# Altium project LED.PrjPcb
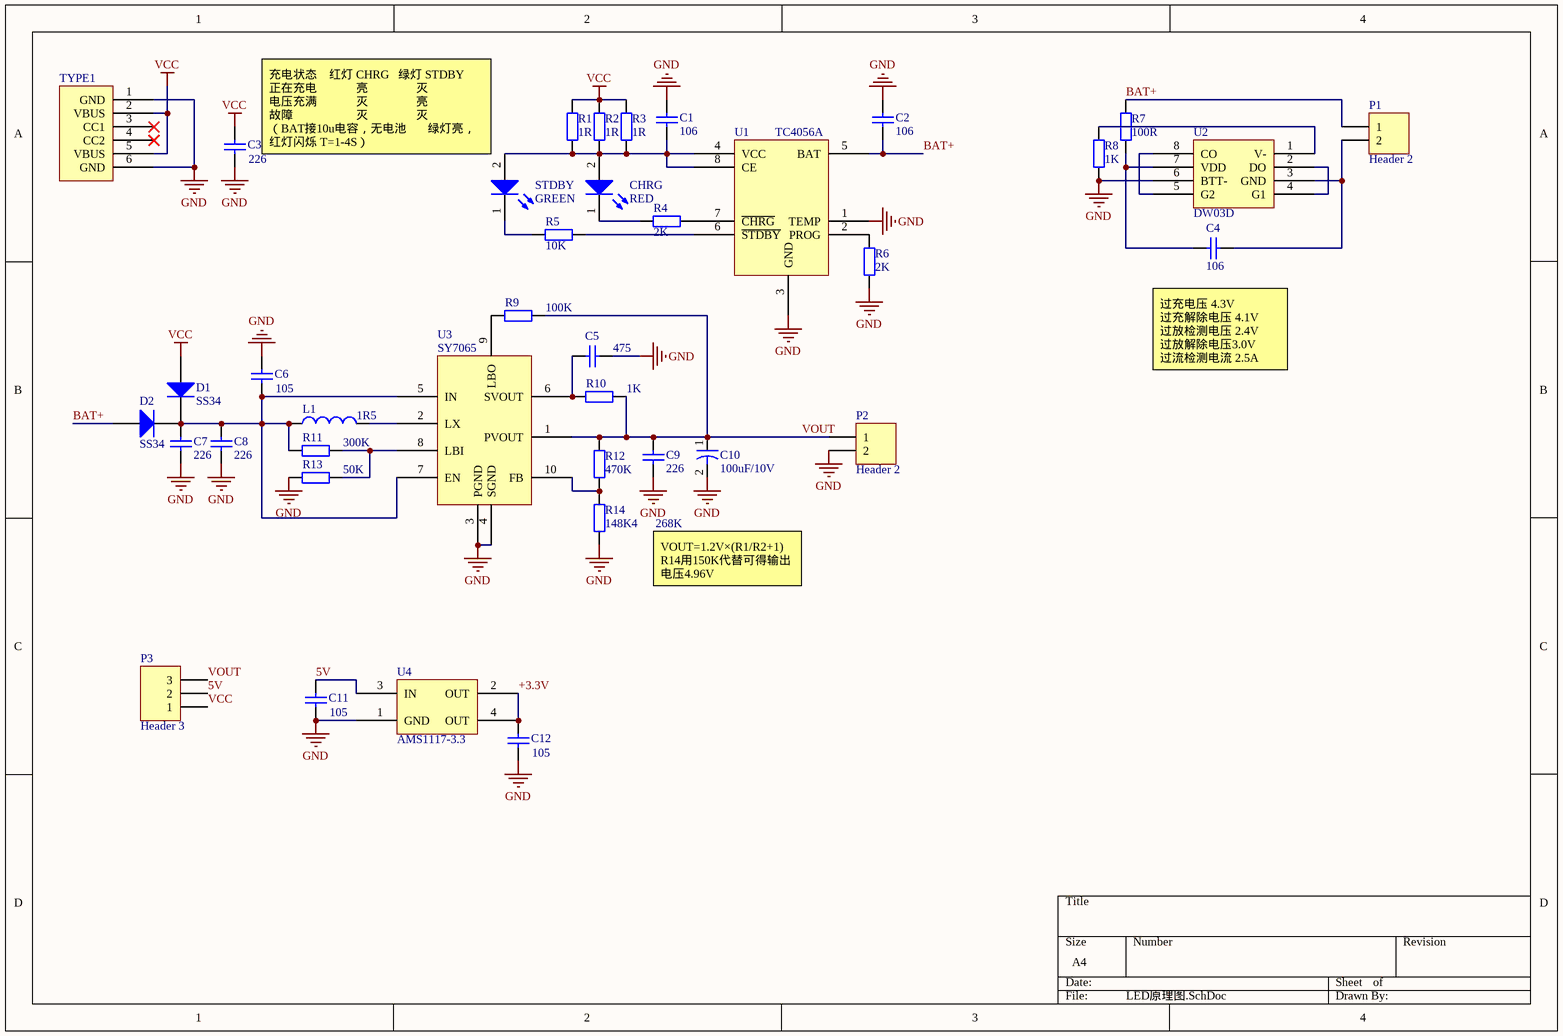
[diagram p0: LED原理图.SchDoc]
3 sheets, 110 parts. Net scope: global (net labels, ports and power ports of the same name join across sheets).
Board file: LED_PCB.PcbDoc
Sheets:
  LED原理图.SchDoc
  BLE主控原理图.SchDoc
  功放原理图.SchDoc

## Sheet LED原理图.SchDoc
size A4

### Parts
C1  value 106  [0805C]  (hidden comment: Cap)
C2  value 106  [0805C]  (hidden comment: Cap)
C3  value 226  [0805C]  (hidden comment: Cap)
C4  value 106  [0805C]  (hidden comment: Cap)
C5  value 475  [0805C]  (hidden comment: Cap)
C6  value 105  [0805C]  (hidden comment: Cap)
C7  value 226  [0805C]  (hidden comment: Cap)
C8  value 226  [0805C]  (hidden comment: Cap)
C9  value 226  [0805C]  (hidden comment: Cap)
C10  value 100uF/10V  [C1206]  (hidden comment: Cap2)
C11  value 105  [0805C]  (hidden comment: Cap)
C12  value 105  [0805C]  (hidden comment: Cap)
CHRG  RED  [LED-0805]
D1  SS34  [LC-SMA(DO-214AC)_S2]
D2  SS34  [LC-SMA(DO-214AC)_S2]
L1  value 1R5  [电感SMD]  (hidden comment: Inductor)
P1  Header 2  [XH2.54-2]
P2  Header 2  [XH2.54-2]
P3  Header 3  [XH2.54-3]
R1  value 1R  [0805R]  (hidden comment: Res2)
R2  value 1R  [0805R]  (hidden comment: Res2)
R3  value 1R  [0805R]  (hidden comment: Res2)
R4  value 2K  [0805R]  (hidden comment: Res2)
R5  value 10K  [0805R]  (hidden comment: Res2)
R6  value 2K  [0805R]  (hidden comment: Res2)
R7  value 100R  [0805R]  (hidden comment: Res2)
R8  value 1K  [0805R]  (hidden comment: Res2)
R9  value 100K  [0805R]  (hidden comment: Res2)
R10  value 1K  [0805R]  (hidden comment: Res2)
R11  value 300K  [0805R]  (hidden comment: Res2)
R12  value 470K  [0805R]  (hidden comment: Res2)
R13  value 50K  [0805R]  (hidden comment: Res2)
R14  value 148K4      268K  [0805R]  (hidden comment: Res2)
STDBY  GREEN  [LED-0805]
TYPE1  TYPE-CF-6P-RAT-L6.8W  [TYPE-CF-6P-RAT-L6.8W]  (value not drawn)
U1  TC4056A  [SOP-8]
U2  DW03D  [LC-TSSOP-8_3x4.4x065P]
U3  SY7065  [QFN2*2-10]
U4  AMS1117-3.3  [SOT-233]

### Nets
5V: C11.2 P3.2 U4.3(IN)
+3.3V: C12.2 U4.2(OUT) U4.4(OUT)
GND: C1.2 C2.2 C3.1 C5.1 C6.2 C7.1 C8.1 C9.2 C10.2 C11.1 C12.1 P2.2 R6.1 R8.2 R13.1 R14.1 TYPE1.1(GND) TYPE1.6(GND) U1.1(TEMP) U1.3(GND) U2.6(BTT-) U3.3(PGND) U3.4(SGND) U4.1(GND)
VCC: C3.2 D1.1(A) P3.1 R1.1 R2.1 R3.1 TYPE1.2(VBUS) TYPE1.5(VBUS)
BAT+: C2.1 D2.1(A) P1.1 R7.1 U1.5(BAT)
VOUT: C9.1 C10.1 P2.1 P3.3 R9.2 R10.2 R12.2 U3.1(PVOUT)
NetC1_1: C1.1 CHRG.2(A) R1.2 R2.2 R3.2 STDBY.2(A) U1.4(VCC) U1.8(CE)
NetC4_1: C4.1 P1.2 U2.3(GND)
NetC4_2: C4.2 R7.2 U2.7(VDD)
NetC5_2: C5.2 R10.1 U3.6(SVOUT)
NetC6_1: C6.1 C7.2 C8.2 D1.2(K) D2.2(K) L1.1 R11.1 U3.5(IN) U3.7(EN)
NetCHRG_1: CHRG.1(K) R4.1
NetL1_2: L1.2 U3.2(LX)
NetR4_2: R4.2 U1.7(~{CHRG})
NetR5_1: R5.1 STDBY.1(K)
NetR5_2: R5.2 U1.6(~{STDBY})
NetR6_2: R6.2 U1.2(PROG)
NetR8_1: R8.1 U2.1(V-)
NetR9_1: R9.1 U3.9(LBO)
NetR11_2: R11.2 R13.2 U3.8(LBI)
NetR12_1: R12.1 R14.2 U3.10(FB)
NetU2_2: U2.2(DO) U2.4(G1)
NetU2_5: U2.5(G2) U2.8(CO)

Not connected (* = marked no-connect by the designer): TYPE1 3(CC1)* 4(CC2)*

### Notes on the sheet
- 充电状态    红灯 CHRG   绿灯 STDBY
  正在充电             亮                灭
  电压充满             灭                亮
  故障                     灭                灭
  （BAT接10u电容，无电池       绿灯亮，红灯闪烁 T=1-4S）
- (near C4) 过充电压 4.3V
  过充解除电压 4.1V
  过放检测电压 2.4V
  过放解除电压3.0V
  过流检测电流 2.5A
- VOUT=1.2V×(R1/R2+1)
  R14用150K代替可得输出电压4.96V

### Library data of the parts
C1-C9 C11 C12 = Cap: Capacitor; Published: 8-Jun-2000; LatestRevisionDate: 17-Jul-2002; LatestRevisionNote: Re-released for DXP Platform.; PackageReference: RAD-0.3; Publisher: Altium Limited; PackageDescription: Radial Cap, Thru-Hole; 2 Leads; 0.3 in Pin Spacing
C10 = Cap2: Capacitor; Published: 23-Sep-2002; PackageReference: CAPR5-4X5; Publisher: Altium Limited; PackageDescription: Capacitor; 2 Leads
CHRG STDBY = LED0: Typical INFRARED GaAs LED; Published: 8-Jun-2000; LatestRevisionDate: 08-Jul-2005; LatestRevisionNote: Mech Layer 1 removed.; PackageReference: LED-0; Publisher: Altium Limited; PackageDescription: LED; 2 Leads
D1 D2 = Diode: Default Diode; Published: 8-Jun-2000; LatestRevisionDate: 17-Jul-2002; LatestRevisionNote: Re-released for DXP Platform.; PackageVersion: Sep-1996; PackageReference: SMC; Publisher: Altium Limited; PackageDescription: DO-214-AB/SMC; 2 C-Bend Leads; Body 7.9 x 5.9 mm, inc. leads (LxW); Code_JEDEC: DO-214-AB
L1 = Inductor: Code_IEC: 1005; Published: 8-Jun-2000; LatestRevisionDate: 29-May-2009; LatestRevisionNote: IPC-7351 Footprint Added.; PackageReference: 0402-A; Publisher: Altium Limited; PackageDescription: Chip Inductor; Code_JEITA: 0402
P1 P2 = Header 2: Header, 2-Pin; LatestRevisionDate: 17-Jul-2002; LatestRevisionNote: Re-released for DXP Platform.; Publisher: Altium Limited
P3 = Header 3: Header, 3-Pin; LatestRevisionDate: 17-Jul-2002; LatestRevisionNote: Re-released for DXP Platform.; Publisher: Altium Limited
R1-R14 = Res2: Resistor; Published: 8-Jun-2000; LatestRevisionDate: 17-Jul-2002; LatestRevisionNote: Re-released for DXP Platform.; PackageReference: AXIAL-0.4; Publisher: Altium Limited; PackageDescription: Axial Device, Thru-Hole; 2 Leads; 0.4 in Pin Spacing

## Sheet BLE主控原理图.SchDoc
size A4
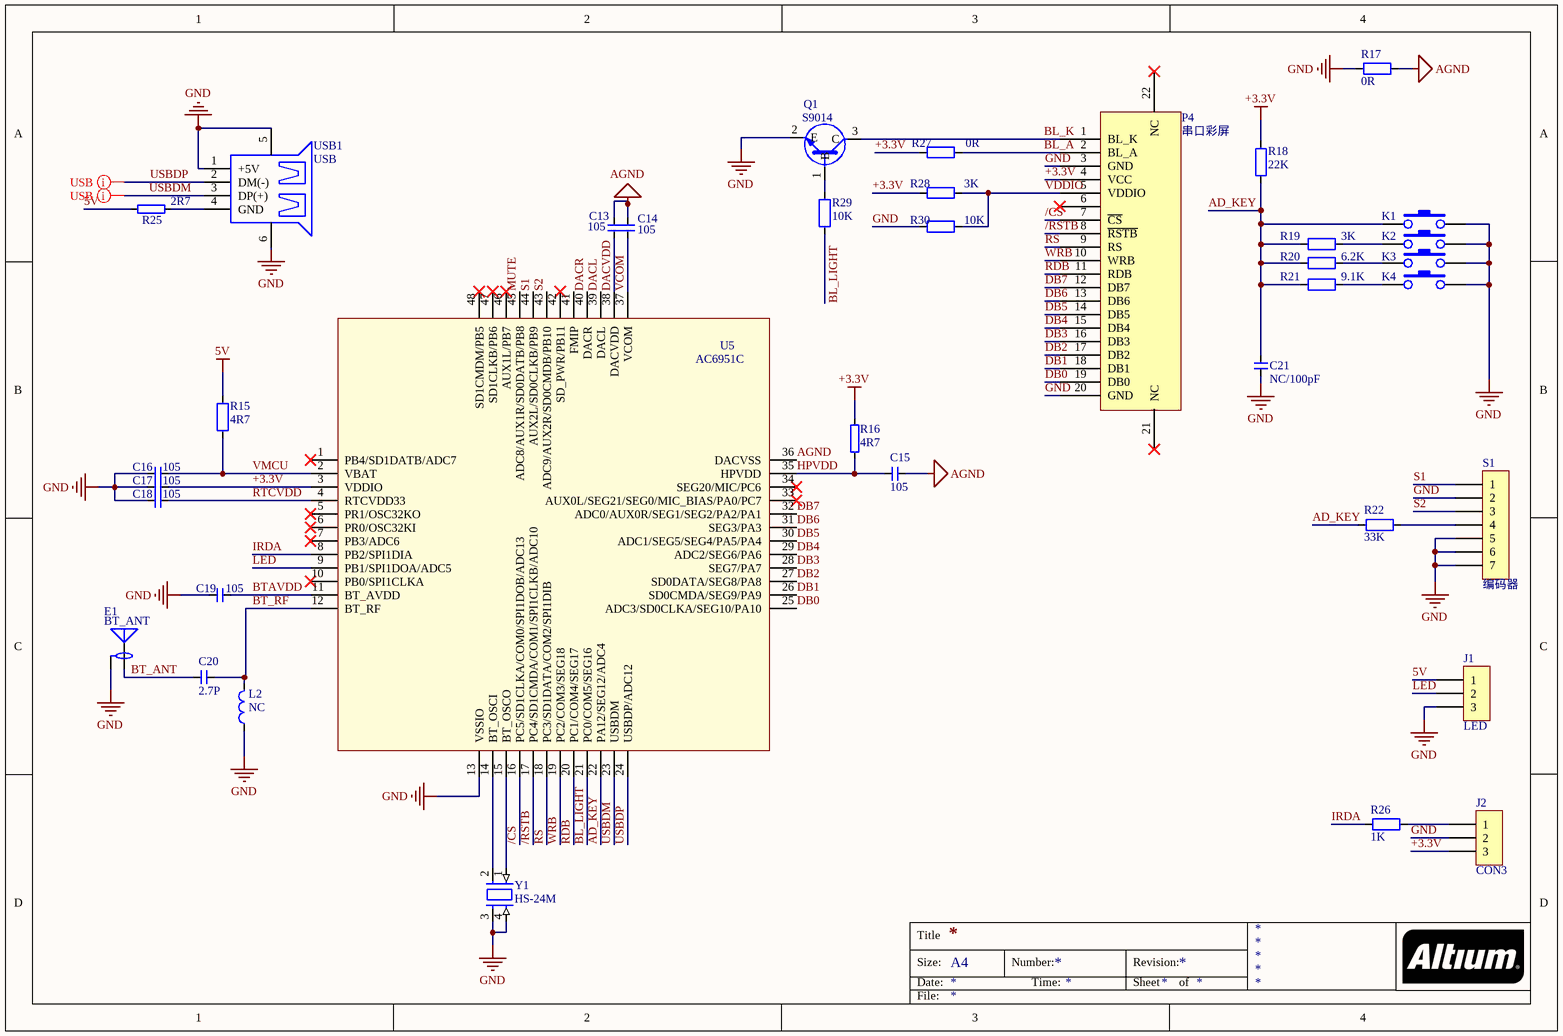
[diagram p1: BLE主控原理图.SchDoc]

### Parts
C13  105  [C0603]
C14  105  [C0603]
C15  105  [C0603]
C16  105  [C0603]
C17  105  [C0603]
C18  105  [C0603]
C19  105  [C0603]
C20  2.7P  [C0603]
C21  NC/100pF  [C0603]
E1  BT_ANT  [新F天线]
J1  LED  [CON-3X2.54]
J2  CON3  [CON-3X2.54]
K1  (no value)  [KEY]
K2  (no value)  [KEY]
K3  (no value)  [KEY]
K4  (no value)  [KEY]
L2  NC  [L0603]
P4  串口彩屏  [FFC-P20-1MM]
Q1  S9014  [SOT23]
R15  4R7  [R0805]
R16  4R7  [R0603]
R17  0R  [R0603]
R18  22K  [R0603]
R19  3K  [R0603]
R20  6.2K  [R0603]
R21  9.1K  [R0603]
R22  33K  [R0603]
R25  2R7  [R0603]
R26  1K  [R0603]
R27  0R  [R0603]
R28  3K  [R0603]
R29  10K  [R0603]
R30  10K  [R0603]
S1  编码器  [BMQ+PUSH]
U5  AC6951C  [LQFP48]
USB1  USB  [USBSMT]
Y1  HS-24M  [JZ]

### Nets
5V: J1.1 R15.1 R25.1
+3.3V: C17.2 J2.3 P4.4(VCC) R16.2 R18.2 R27.1 R28.2 U5.3(VDDIO)
AGND: C13.2 C14.2 C15.1 R17.2 U5.36(DACVSS)
GND: C16.1 C17.1 C18.1 C19.1 C21.2 E1.2 J1.3 J2.2 K1.2 K2.2 K3.2 K4.2 L2.1 P4.3(GND) P4.20(GND) Q1.2(E) R17.1 R30.2 S1.2 S1.5 S1.6 S1.7 U5.13(VSSIO) USB1.1(+5V) USB1.5 USB1.6 Y1.3 Y1.4
/CS: P4.7(~{CS}) U5.16(PC5/SD1CLKA/COM0/SPI1DOB/ADC13)
/RSTB: P4.8(~{RSTB}) U5.17(PC4/SD1CMDA/COM1/SPI1CLKB/ADC10)
AD_KEY: C21.1 K1.1 R18.1 R19.1 R20.1 R21.1 R22.1 U5.22(PA12/SEG12/ADC4)
BL_A: P4.2(BL_A) R27.2
BL_K: P4.1(BL_K) Q1.3(C)
BL_LIGHT: R29.1 U5.21(PC0/COM5/SEG16)
BT_ANT: C20.1 E1.1
BT_RF: C20.2 L2.2 U5.12(BT_RF)
BTAVDD: C19.2 U5.11(BT_AVDD)
DACL: U5.39(DACL)
DACR: U5.40(DACR)
DACVDD: C13.1 U5.38(DACVDD)
DB0: P4.19(DB0) U5.25(ADC3/SD0CLKA/SEG10/PA10)
DB1: P4.18(DB1) U5.26(SD0CMDA/SEG9/PA9)
DB2: P4.17(DB2) U5.27(SD0DATA/SEG8/PA8)
DB3: P4.16(DB3) U5.28(SEG7/PA7)
DB4: P4.15(DB4) U5.29(ADC2/SEG6/PA6)
DB5: P4.14(DB5) U5.30(ADC1/SEG5/SEG4/PA5/PA4)
DB6: P4.13(DB6) U5.31(SEG3/PA3)
DB7: P4.12(DB7) U5.32(ADC0/AUX0R/SEG1/SEG2/PA2/PA1)
HPVDD: C15.2 R16.1 U5.35(HPVDD)
IRDA: R26.1 U5.8(PB2/SPI1DIA)
LED: J1.2 U5.9(PB1/SPI1DOA/ADC5)
MUTE: U5.45(ADC8/AUX1R/SD0DATB/PB8)
RDB: P4.11(RDB) U5.20(PC1/COM4/SEG17)
RS: P4.9(RS) U5.18(PC3/SD1DATA/COM2/SPI1DIB)
RTCVDD: C18.2 U5.4(RTCVDD33)
S1: S1.1 U5.44(AUX2L/SD0CLKB/PB9)
S2: S1.3 U5.43(ADC9/AUX2R/SD0CMDB/PB10)
USBDM: U5.23(USBDM) USB1.3(DP(+))
USBDP: U5.24(USBDP/ADC12) USB1.2(DM(-))
VCOM: C14.1 U5.37(VCOM)
VDDIO: P4.5(VDDIO) R28.1 R30.1
VMCU: C16.2 R15.2 U5.2(VBAT)
WRB: P4.10(WRB) U5.19(PC2/COM3/SEG18)
NetJ2_1: J2.1 R26.2
NetK2_1: K2.1 R19.2
NetK3_1: K3.1 R20.2
NetK4_1: K4.1 R21.2
NetQ1_1: Q1.1(B) R29.2
NetR22_2: R22.2 S1.4
NetR25_2: R25.2 USB1.4(GND)
NetU5_14: U5.14(BT_OSCI) Y1.2
NetU5_15: U5.15(BT_OSCO) Y1.1

Not connected (* = marked no-connect by the designer): P4 6* 21(NC)* 22(NC)*; U5 1(PB4/SD1DATB/ADC7)* 5(PR1/OSC32KO)* 6(PR0/OSC32KI)* 7(PB3/ADC6)* 10(PB0/SPI1CLKA)* 33(AUX0L/SEG21/SEG0/MIC_BIAS/PA0/PC7)* 34(SEG20/MIC/PC6)* 41(FMIP) 42(SD_PWR/PB11)* 46(AUX1L/PB7)* 47(SD1CLKB/PB6)* 48(SD1CMDM/PB5)*

### Layout directives
USBDP: True: USBDP
USBDM: True: USBDM

### Notes on the sheet
- Title
- Size:
- Date:
- A4
- Number:
- Time:
- Revision:
- Sheet
- of
- File:

### Library data of the parts
C13-C21 = CAP-0603
J1 J2 = CON3: Connector
K1-K4 = Key
L2 = L
P4 = LCD-20P
Q1 = NPN
R15 R17-R22 R26-R30 = RES-0603
R16 R25 = RES
S1 = CON7: Connector
Y1 = CRYSTAL

## Sheet 功放原理图.SchDoc
size A4
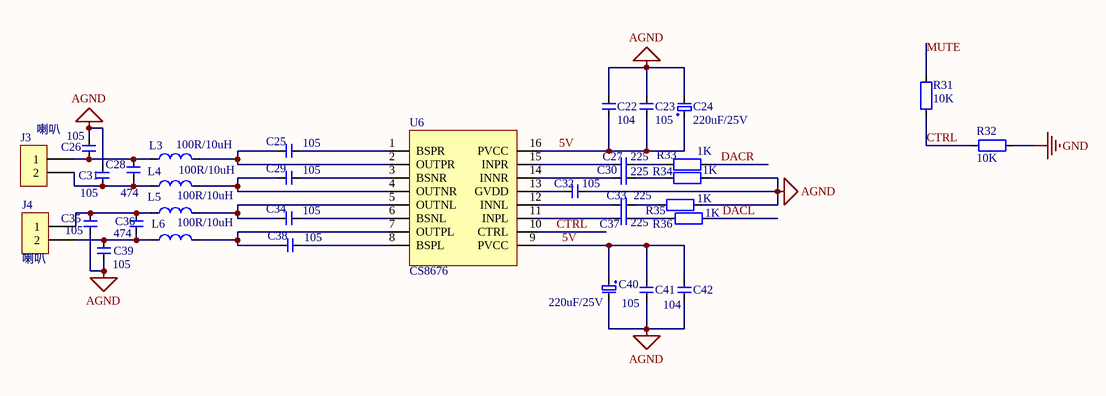
[diagram p2: 功放原理图.SchDoc]

### Parts
C22  104  [C0603]
C23  105  [C0603]
C24  220uF/25V  [EC2.5-6.3]
C25  105  [C0603]
C26  105  [C0603]
C27  225  [C0603]
C28  474  [C0603]
C29  105  [C0603]
C30  225  [C0603]
C31  105  [C0603]
C32  105  [C0603]
C33  225  [C0603]
C34  105  [C0603]
C35  105  [C0603]
C36  474  [C0603]
C37  225  [C0603]
C38  105  [C0603]
C39  105  [C0603]
C40  220uF/25V  [EC2.5-6.3]
C41  105  [C0603]
C42  104  [C0603]
J3  喇叭  [CON-2X2.54]
J4  喇叭  [CON-2X2.54]
L3  100R/10uH  [R1206]
L4  100R/10uH  [R1206]
L5  100R/10uH  [R1206]
L6  100R/10uH  [R1206]
R31  10K  [R0603]
R32  10K  [R0603]
R33  1K  [R0603]
R34  1K  [R0603]
R35  1K  [R0603]
R36  1K  [R0603]
U6  CS8676  [SOP16-EP]

### Nets
5V: C22.1 C23.1 C24.1 C40.1 C41.1 C42.1 U6.9(PVCC) U6.16(PVCC)
AGND: C22.2 C23.2 C24.2 C26.2 C31.2 C32.2 C35.2 C39.2 C40.2 C41.2 C42.2 R34.2 R35.2
GND: R32.2
CTRL: R31.1 R32.1 U6.10(CTRL)
DACL: R36.2
DACR: R33.2
MUTE: R31.2
NetC25_1: C25.1 L3.2 U6.2(OUTPR)
NetC25_2: C25.2 U6.1(BSPR)
NetC26_1: C26.1 C28.2 J3.1 L3.1
NetC27_1: C27.1 U6.15(INPR)
NetC27_2: C27.2 R33.1
NetC28_1: C28.1 C31.1 J3.2 L4.1
NetC29_1: C29.1 L4.2 U6.4(OUTNR)
NetC29_2: C29.2 U6.3(BSNR)
NetC30_1: C30.1 U6.14(INNR)
NetC30_2: C30.2 R34.1
NetC32_1: C32.1 U6.13(GVDD)
NetC33_1: C33.1 U6.12(INNL)
NetC33_2: C33.2 R35.1
NetC34_1: C34.1 L5.2 U6.5(OUTNL)
NetC34_2: C34.2 U6.6(BSNL)
NetC35_1: C35.1 C36.2 J4.1 L5.1
NetC36_1: C36.1 C39.1 J4.2 L6.1
NetC37_1: C37.1 U6.11(INPL)
NetC37_2: C37.2 R36.1
NetC38_1: C38.1 L6.2 U6.7(OUTPL)
NetC38_2: C38.2 U6.8(BSPL)

### Notes on the sheet
- Title
- Size:
- Date:
- A4
- Number:
- Time:
- Revision:
- Sheet
- of
- File:

### Library data of the parts
C22 C23 C25-C39 C41 C42 = CAP-0603
C24 C40 = +CAP
J3 J4 = CON2: Connector
L3-L6 = L
R31-R36 = RES-0603

## Nets that join several sheets
5V: LED原理图 (C11.2 P3.2 U4.3), BLE主控原理图 (J1.1 R15.1 R25.1), 功放原理图 (8 pins)
+3.3V: LED原理图 (C12.2 U4.2 U4.4), BLE主控原理图 (8 pins)
AGND: BLE主控原理图 (5 pins), 功放原理图 (13 pins)
GND: LED原理图 (24 pins), BLE主控原理图 (28 pins), 功放原理图 (R32.2)
DACL: BLE主控原理图 (U5.39), 功放原理图 (R36.2)
DACR: BLE主控原理图 (U5.40), 功放原理图 (R33.2)
MUTE: BLE主控原理图 (U5.45), 功放原理图 (R31.2)